# Altium project ADC_Comm.PrjPcb
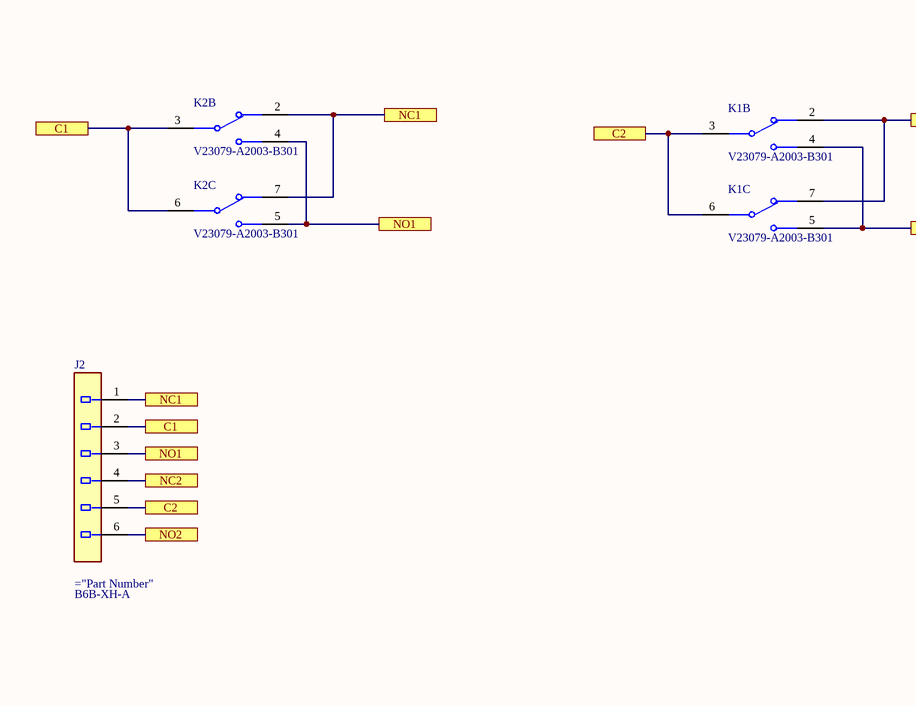
[diagram p0: ADC_Comm.SchDoc, top left]
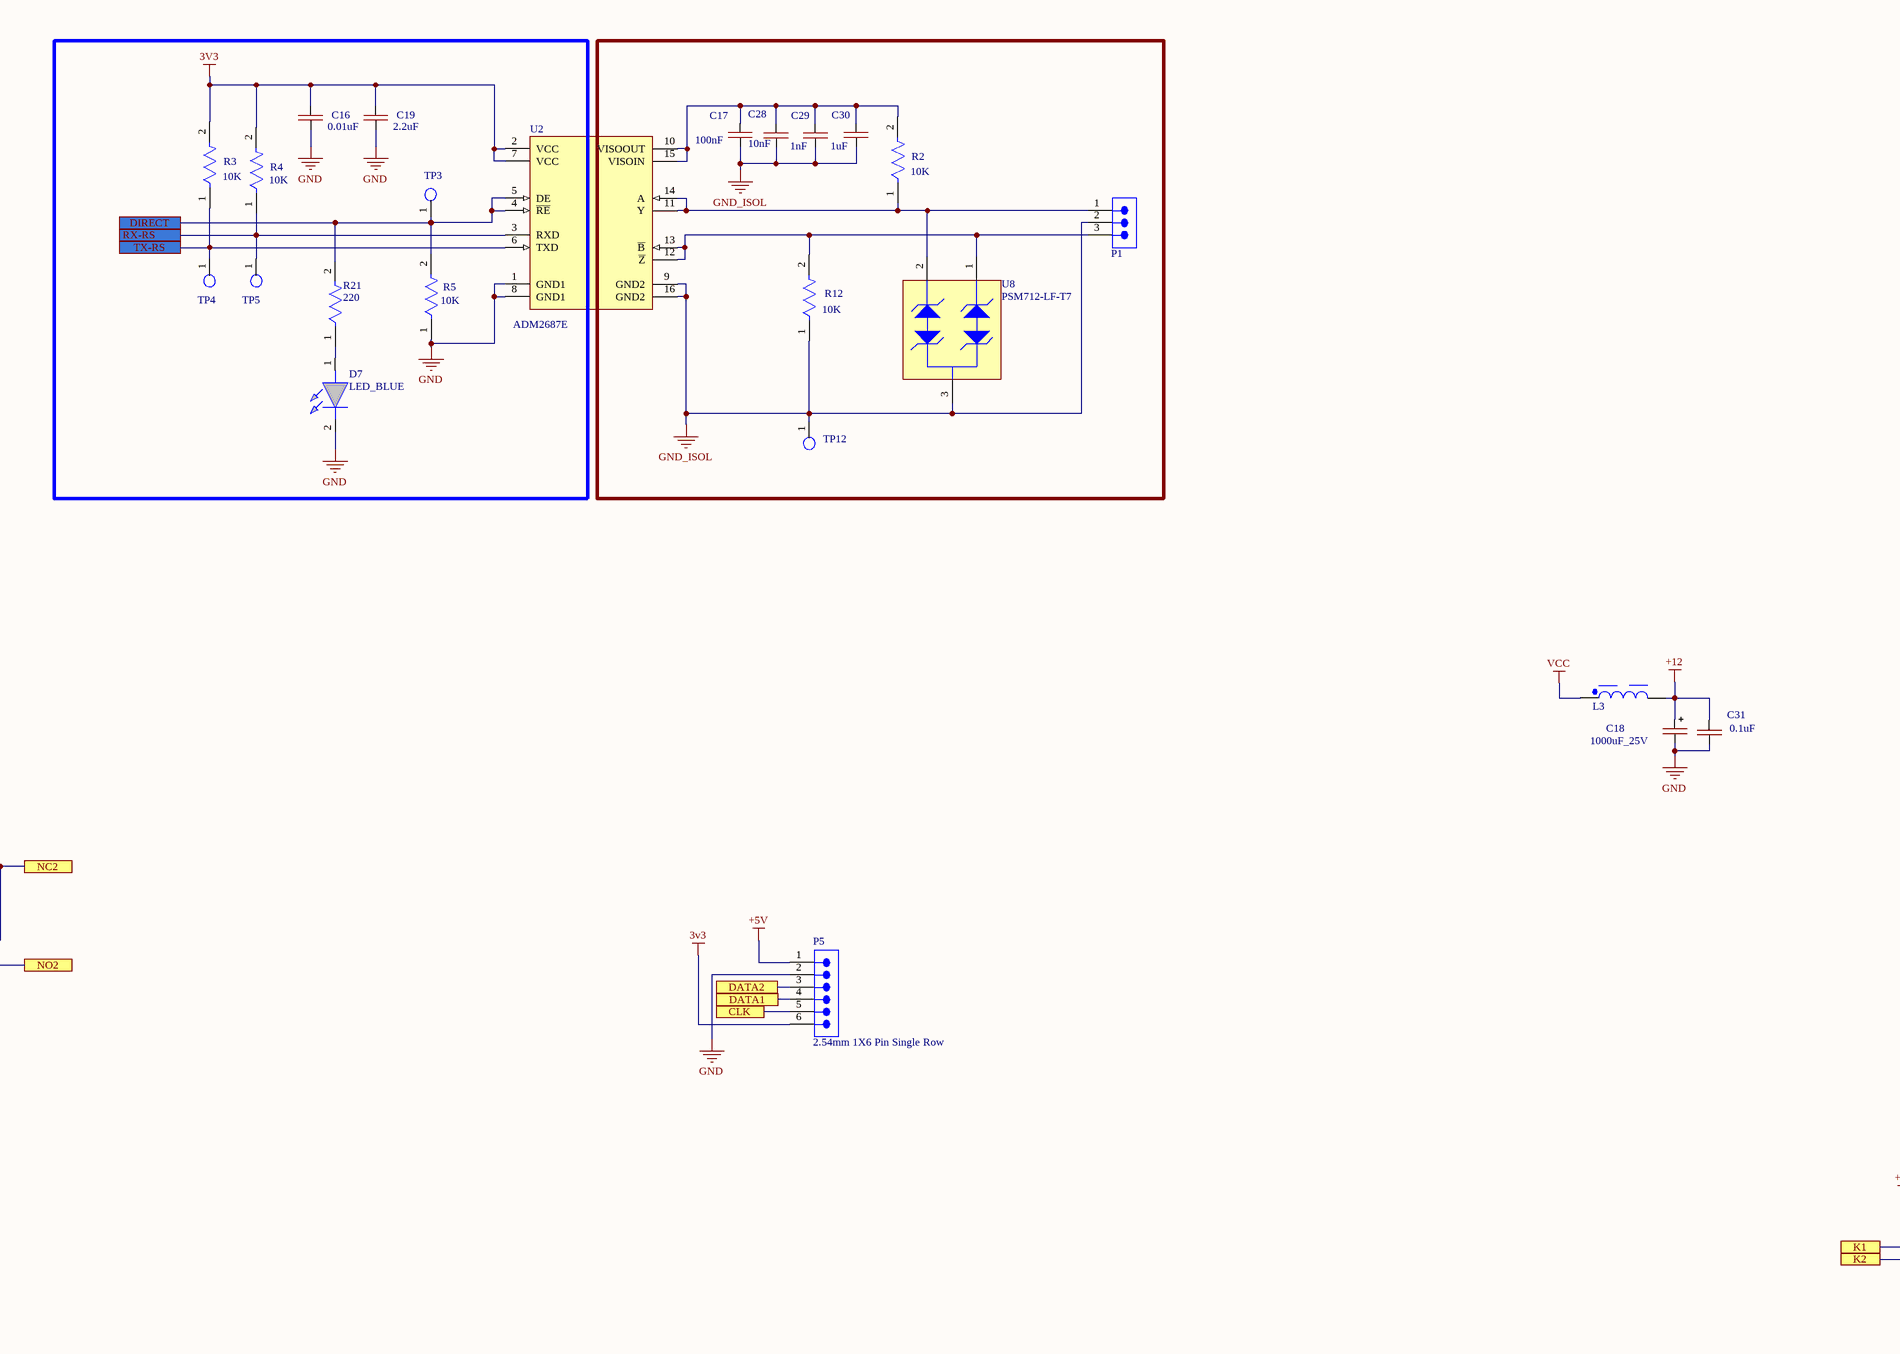
[diagram p1: ADC_Comm.SchDoc, top middle]
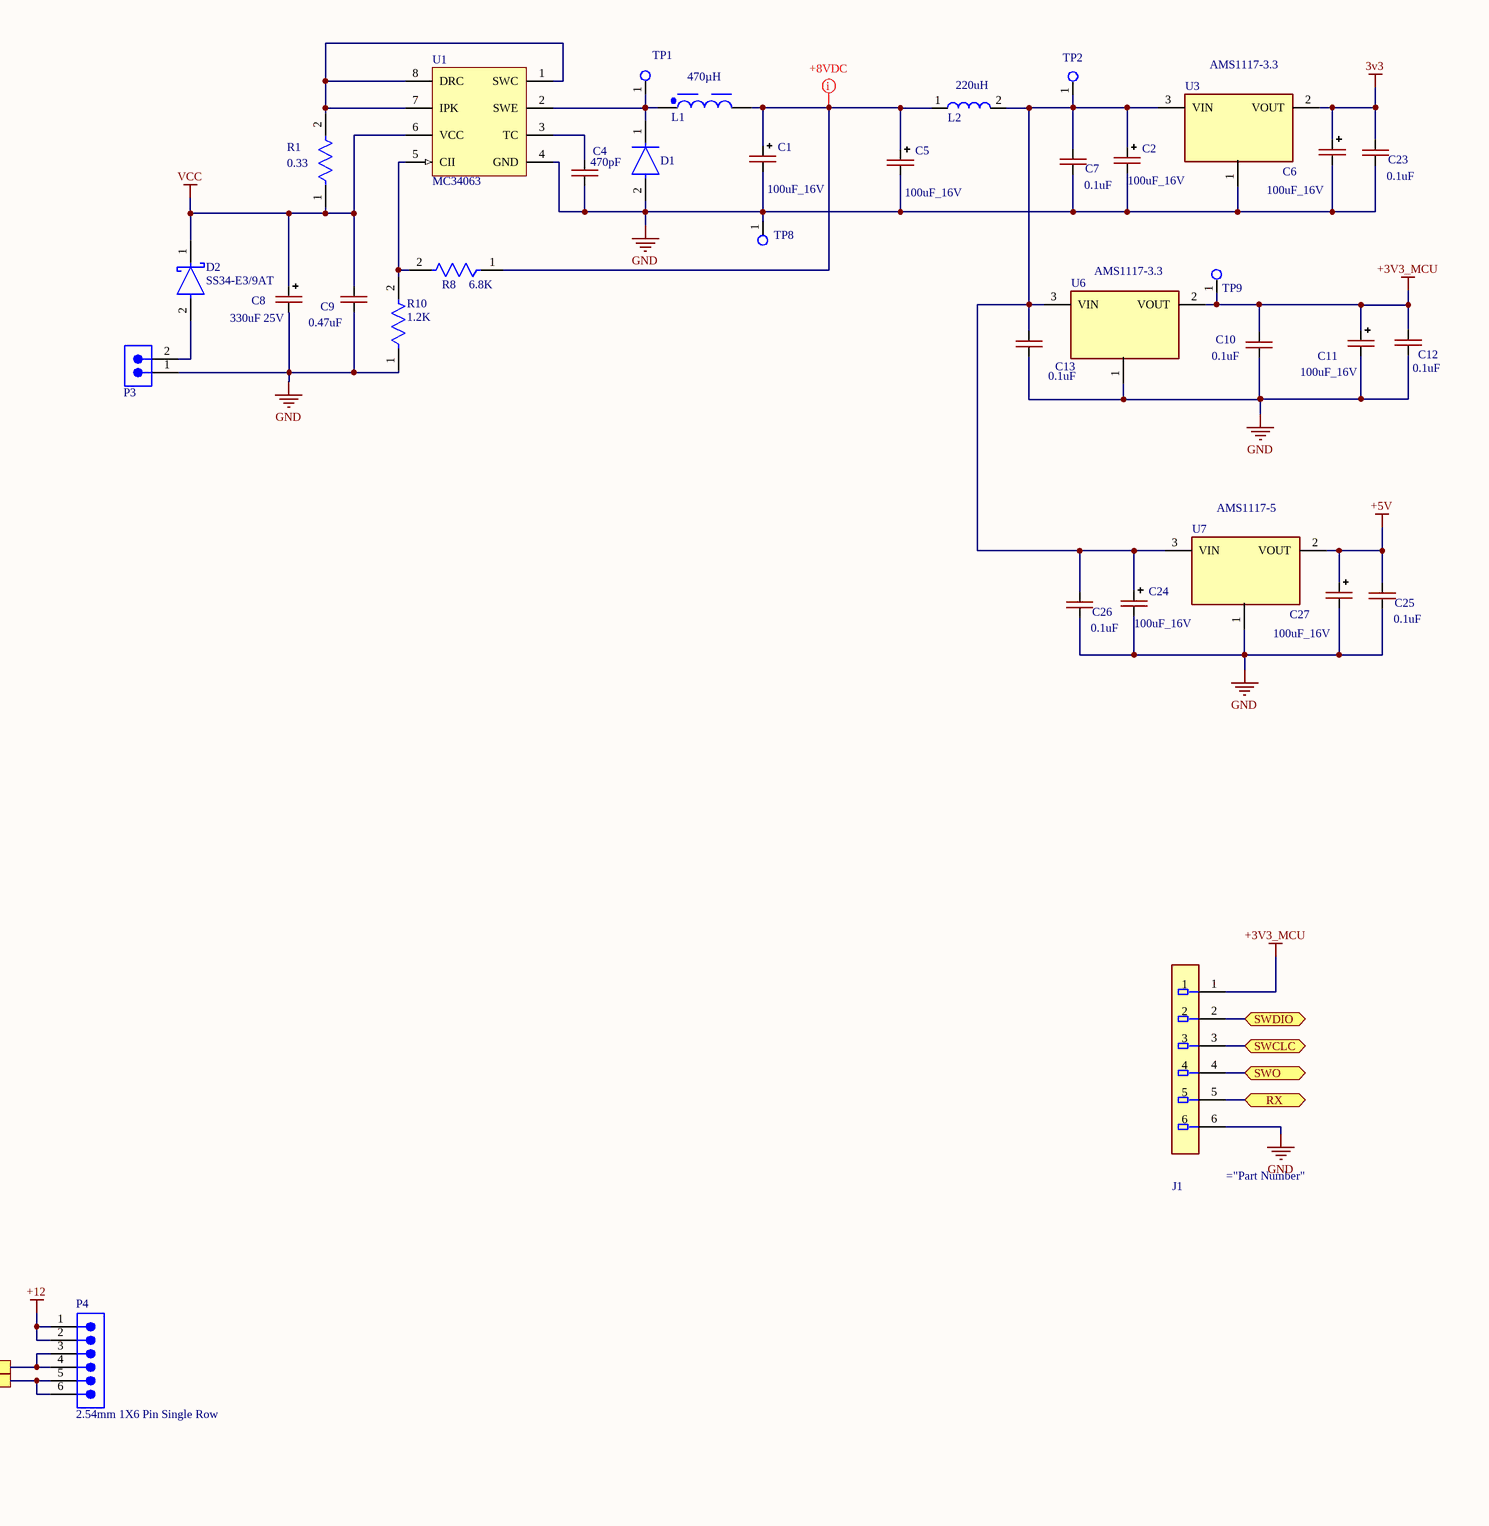
[diagram p2: ADC_Comm.SchDoc, top right]
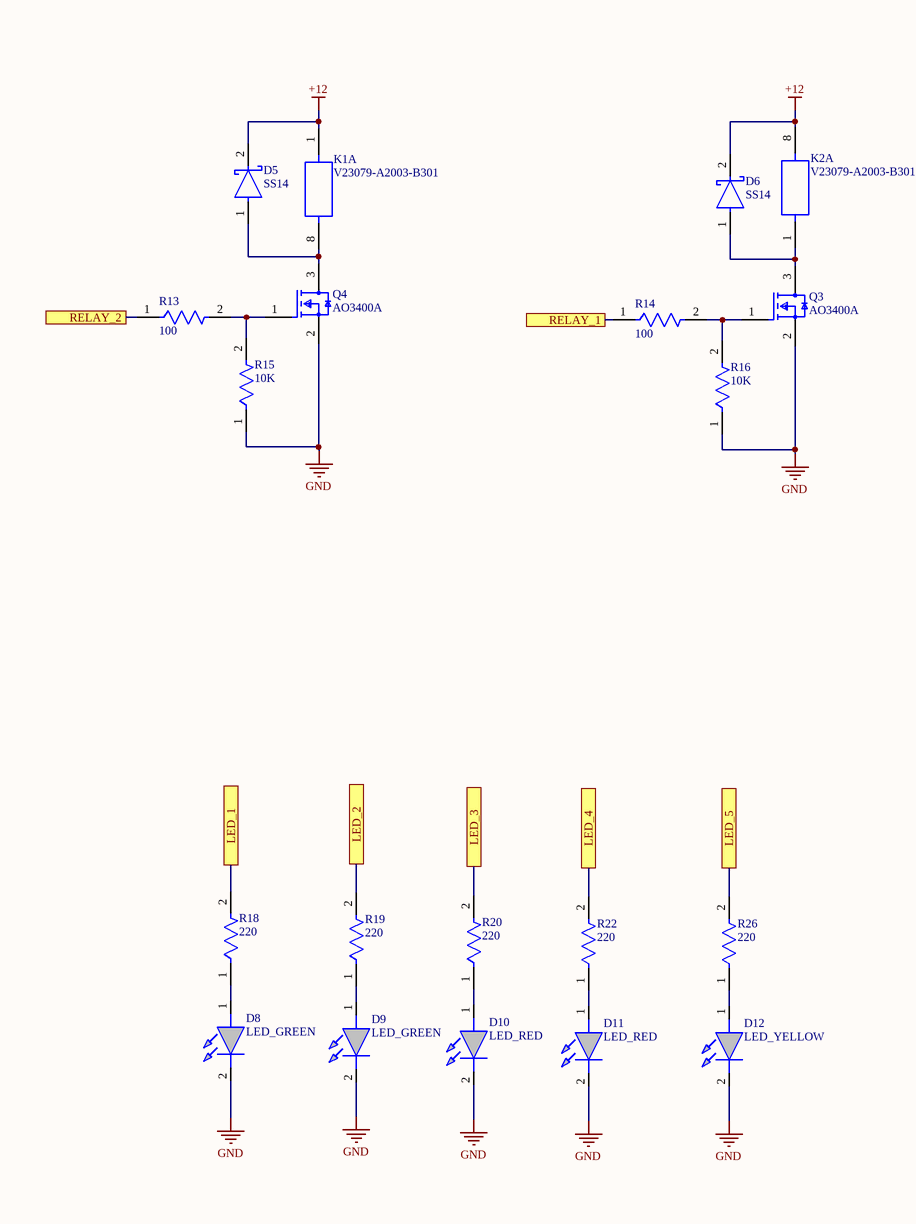
[diagram p3: ADC_Comm.SchDoc, bottom left]
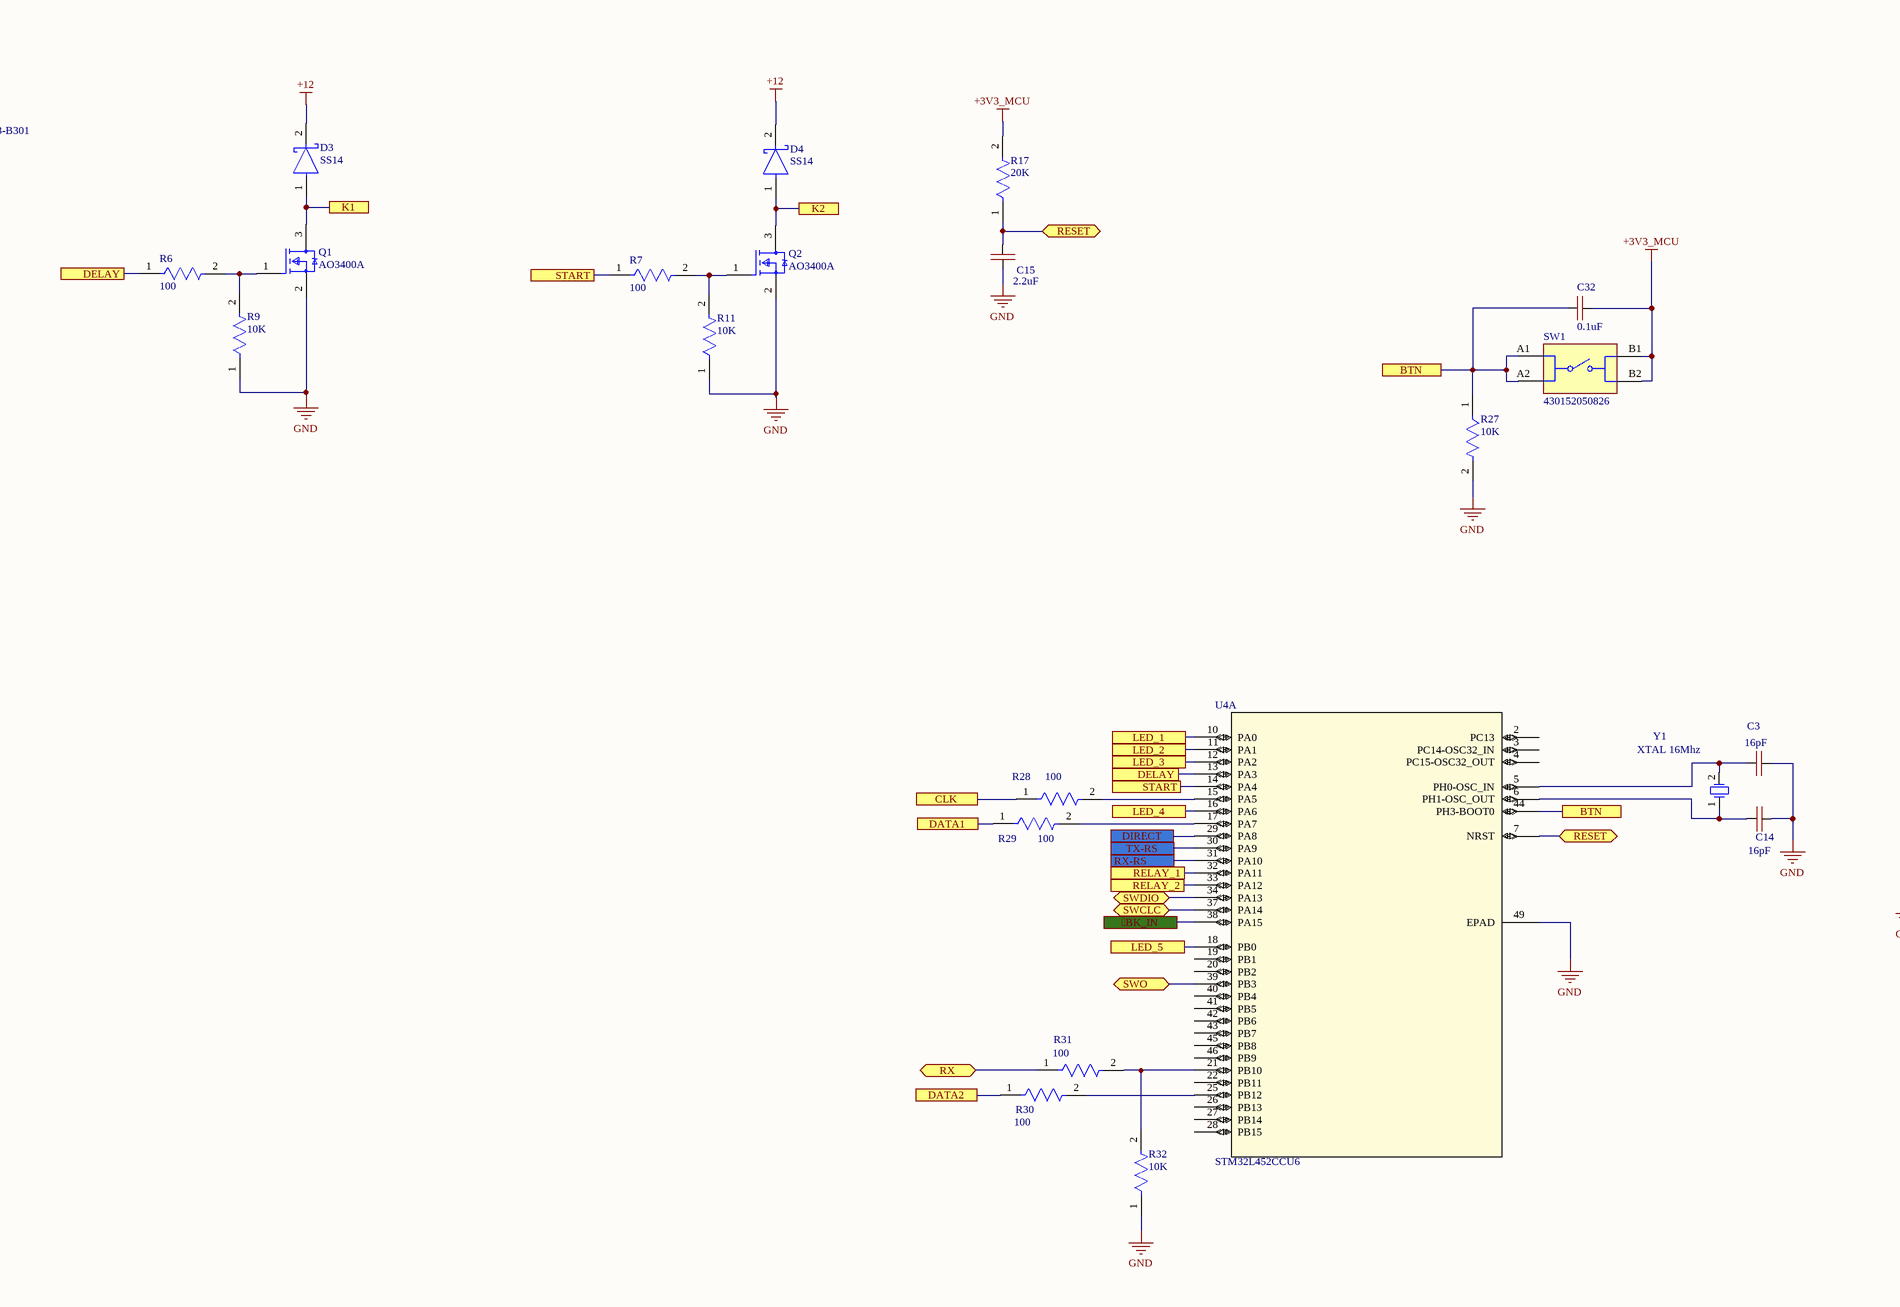
[diagram p4: ADC_Comm.SchDoc, bottom middle]
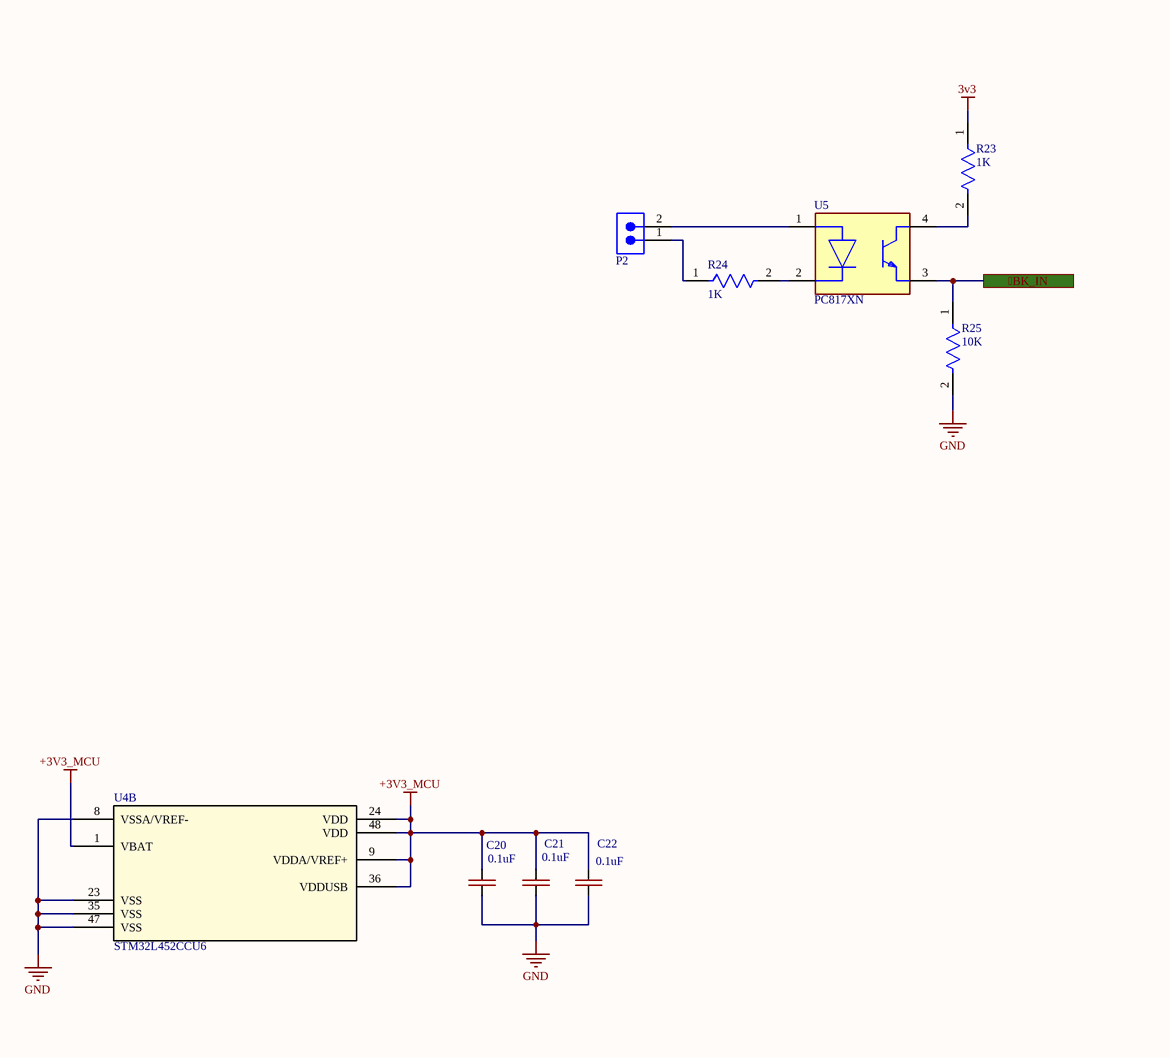
[diagram p5: ADC_Comm.SchDoc, bottom right]
1 sheet, 110 parts. Net scope: flat (ports and power ports of the same name join across sheets).
Board file: ADC_Comm.PcbDoc

## Sheet ADC_Comm.SchDoc
size A0; SheetNumber: 1; SheetTotal: 1; SPICEModelCacheIBWEWSKS: <root> / <DocumentId>IBWEWSKS</DocumentId> / <CacheFrame Number="0"> / <Model Name="5848_744774033_3.3u" Kind="CKT"> / <Text>******* / .subckt 5848_744774033_3.3u 1 2 / Rp 1 2 12000 / Cp 1 2 3.4p / Rs 1 N3 0.042 / L1 N3 2 3.3u / .ends 5848_744774033_3.3u</Text> / </Model> / <Model Name="1054_744776127_27u" Kind="CKT"> / <Text>******* / .subckt 1054_744776127_27u 1 2 / Rp 1 2 22000 / Cp 1 2 4.7p / Rs 1 N3 0.0627 / L1 N3 2 27u / .ends 1054_744776127_27u</Text> / </Model> / </CacheFrame> / </root>

### Parts
C1  100uF_16V  [CAP-TAN-D]
C2  100uF_16V  [CAP-TAN-D]
C3  16pF  [CAP-0402]
C4  470pF  [CAP-0603]
C5  100uF_16V  [CAP-TAN-D]
C6  100uF_16V  [CAP-TAN-D]
C7  0.1uF  [CAP-0603]
C8  330uF 25V  [CAP_SMD_Size_E]
C9  0.47uF  [CAP-0805]
C10  0.1uF  [CAP-0603]
C11  100uF_16V  [CAP-TAN-D]
C12  0.1uF  [CAP-0603]
C13  0.1uF  [CAP-0603]
C14  16pF  [CAP-0402]
C15  2.2uF  [CAP-0805]
C16  0.01uF  [CAP-0805]
C17  100nF  [CAP-0603]
C18  1000uF_25V  [CAP_SMD_SIZE_H]
C19  2.2uF  [CAP-0805]
C20  0.1uF  [CAP-0603]
C21  0.1uF  [CAP-0603]
C22  0.1uF  [CAP-0603]
C23  0.1uF  [CAP-0603]
C24  100uF_16V  [CAP-TAN-D]
C25  0.1uF  [CAP-0603]
C26  0.1uF  [CAP-0603]
C27  100uF_16V  [CAP-TAN-D]
C28  10nF  [CAP-0603]
C29  1nF  [CAP-0603]
C30  1uF  [CAP-0603]
C31  0.1uF  [CAP-0805]
C32  0.1uF  [CAP-0603]
D1  ES1G  [FP-403AE-MFG]  (value not drawn)
D2  SS34-E3/9AT  [FP-SMC-MFG]
D3  SS14  [DO-214-AC]
D4  SS14  [DO-214-AC]
D5  SS14  [DO-214-AC]
D6  SS14  [DO-214-AC]
D7  LED_BLUE  [LED_BLUE]
D8  LED_GREEN  [LED_GREEN]
D9  LED_GREEN  [LED_GREEN]
D10  LED_RED  [LED_RED]
D11  LED_RED  [LED_RED]
D12  LED_YELLOW  [LED_YELLOW]
J1  KF2510 Connector 2.54mm  [Sullins_SWR25X-NRTC-S06-ST-BA_MFG]  (value not drawn)
J2  B6B-XH-A  [B6B-XH-TW]
K1  V23079-A2003-B301  [V23079-A1001-B301]  (parts A,B,C of 3)
K2  V23079-A2003-B301  [V23079-A1001-B301]  (parts A,B,C of 3)
L1  470µH  [WE-PD2_5848]
L2  220uH  [Coil_4.5x4.5_mm]
L3  27µH, 1.95A  [WE-PD2_1054]  (value not drawn)
P1  691305340003  [691305340003]  (value not drawn)
P2  691322310002  [691322310002]  (value not drawn)
P3  691322310002  [691322310002]  (value not drawn)
P4  2.54mm 1X6 Pin Single Row  [PLS2.54 1x6 25mm]
P5  2.54mm 1X6 Pin Single Row  [PLS2.54 1x6 25mm]
Q1  AO3400A  [FP-SOT23-MFG]
Q2  AO3400A  [FP-SOT23-MFG]
Q3  AO3400A  [FP-SOT23-MFG]
Q4  AO3400A  [FP-SOT23-MFG]
R1  0.33  [RES-1206]
R2  10K  [RES-0603]
R3  10K  [RES-0603]
R4  10K  [RES-0603]
R5  10K  [RES-0603]
R6  100  [RES-0603]
R7  100  [RES-0603]
R8  6.8K  [RES-0805]
R9  10K  [RES-0603]
R10  1.2K  [RES-0805]
R11  10K  [RES-0603]
R12  10K  [RES-0603]
R13  100  [RES-0603]
R14  100  [RES-0603]
R15  10K  [RES-0603]
R16  10K  [RES-0603]
R17  20K  [RES-0603]
R18  220  [RES-0603]
R19  220  [RES-0603]
R20  220  [RES-0603]
R21  220  [RES-0603]
R22  220  [RES-0603]
R23  1K  [RES-0603]
R24  1K  [RES-0603]
R25  10K  [RES-0603]
R26  220  [RES-0603]
R27  10K  [RES-0603]
R28  100  [RES-0603]
R29  100  [RES-0603]
R30  100  [RES-0603]
R31  100  [RES-0603]
R32  10K  [RES-0603]
SW1  430152050826  [430152050826]
TP1  Test_Point_PCB  [Test_Point]  (value not drawn)
TP2  Test_Point_PCB  [Test_Point]  (value not drawn)
TP3  Test_Point_PCB  [Test_Point]  (value not drawn)
TP4  Test_Point_PCB  [Test_Point]  (value not drawn)
TP5  Test_Point_PCB  [Test_Point]  (value not drawn)
TP8  Test_Point_PCB  [Pin_Test_Point(Orange)]  (value not drawn)
TP9  Test_Point_PCB  [Test_Point]  (value not drawn)
TP12  Test_Point_PCB  [Test_Point]  (value not drawn)
U1  MC34063  [SOIC-8_M]
U2  ADM2687E  [ADI-RI-16-2_M]
U3  AMS1117-3.3  [SOT-89]
U4  STM32L452CCU6  [UFQFPN48-7x7mm_STM]  (parts A,B of 2)
U5  PC817XN  [FP-PC817XNNIP0F-MFG]
U6  AMS1117-3.3  [SOT-89]
U7  AMS1117-5  [SOT-89]
U8  PSM712-LF-T7  [PRKT-SOT23-3_V]
Y1  XTAL 16Mhz  [HC-49_SMD]

### Ports
BK_IN (see ADC_Comm[6C]), BK_IN (see ADC_Comm[11C]), BTN (see ADC_Comm[7C]), BTN (see ADC_Comm[8C]), C2 (see ADC_Comm[1B]), C2 (see ADC_Comm[2B]), CLK (see ADC_Comm[5B]), CLK (see ADC_Comm[6C]), DATA1 (see ADC_Comm[5B]), DATA1 (see ADC_Comm[6C]), DATA2 (see ADC_Comm[5B]), DATA2 (see ADC_Comm[6C]), DELAY (see ADC_Comm[3C]), DELAY (see ADC_Comm[6C]), DIRECT (see ADC_Comm[3A]), DIRECT (see ADC_Comm[6C]), K1 (see ADC_Comm[4B]), K1 (see ADC_Comm[9B]), K2 (see ADC_Comm[5B]), K2 (see ADC_Comm[9B]), LED_1 (see ADC_Comm[1C]), LED_1 (see ADC_Comm[6C]), LED_2 (see ADC_Comm[2C]), LED_2 (see ADC_Comm[6C]), LED_3 (see ADC_Comm[2C]), LED_3 (see ADC_Comm[6C]), LED_4 (see ADC_Comm[2C]), LED_4 (see ADC_Comm[6C]), LED_5 (see ADC_Comm[3C]), LED_5 (see ADC_Comm[6C]), NC1 (see ADC_Comm[1B]), NC1 (see ADC_Comm[2B]), NC2 (see ADC_Comm[1B]), NC2 (see ADC_Comm[3B]), NO1 (see ADC_Comm[1B]), NO1 (see ADC_Comm[2B]), NO2 (see ADC_Comm[1B]), NO2 (see ADC_Comm[3B]), RELAY_1 (see ADC_Comm[2C]), RELAY_1 (see ADC_Comm[6C]), RELAY_2 (see ADC_Comm[1C]), RELAY_2 (see ADC_Comm[6C]), RESET (bidir, see ADC_Comm[6B]), RESET (bidir, see ADC_Comm[8C]), RX (bidir, see ADC_Comm[6C]), RX (bidir, see ADC_Comm[12B]), RX-RS (see ADC_Comm[3A]), RX-RS (see ADC_Comm[6C]), START (see ADC_Comm[5C]), START (see ADC_Comm[6C]), SWCLC (bidir, see ADC_Comm[6C]), SWCLC (bidir, see ADC_Comm[12B]), SWDIO (bidir, see ADC_Comm[6C]), SWDIO (bidir, see ADC_Comm[12B]), SWO (bidir, see ADC_Comm[6C]), SWO (bidir, see ADC_Comm[12B]), TX-RS (see ADC_Comm[3A]), TX-RS (see ADC_Comm[6C]), С1 (see ADC_Comm[1B])

### Nets
3v3: C6.1(+) C16.1 C19.1 C23.2 P5.6 R3.2 R4.2 R23.1 U2.2(VCC) U2.7(VCC) U3.2(VOUT)
+3V3_MCU: C10.2 C11.1(+) C12.2 C20.2 C21.2 C22.2 C32.1 J1.1 R17.2 SW1.B1 SW1.B2 TP9.1(G9) U4.1(VBAT) U4.9(VDDA/VREF+) U4.24(VDD) U4.36(VDDUSB) U4.48(VDD) U6.2(VOUT)
+5V: C25.2 C27.1(+) P5.1 U7.2(VOUT)
+12: C18.1(+) C31.2 D3.2(C) D4.2(C) D5.2(C) D6.2(C) K1.1 K2.8 L3.2 P4.1 P4.2
GND: C1.2(-) C2.2(-) C3.1 C4.2 C5.2(-) C6.2(-) C7.1 C8.2(-) C9.2 C10.1 C11.2(-) C12.1 C13.1 C14.2 C15.1 C16.2 C18.2(-) C19.2 C20.1 C21.1 C22.1 C23.1 C24.2(-) C25.1 C26.1 C27.2(-) C31.1 D1.2(A) D7.2(K) D8.2(K) D9.2(K) D10.2(K) D11.2(K) D12.2(K) J1.6 P3.1 P5.2 Q1.2(S) Q2.2(S) Q3.2(S) Q4.2(S) R5.1 R9.1 R10.1 R11.1 R15.1 R16.1 R25.2 R27.2 R32.1 TP8.1(G9) U1.4(GND) U2.1(GND1) U2.8(GND1) U3.1(Ground) U4.8(VSSA/VREF-) U4.23(VSS) U4.35(VSS) U4.47(VSS) U4.49(EPAD) U6.1(Ground) U7.1(Ground)
GND_ISOL: C17.2 C28.2 C29.2 C30.2 P1.2 R12.1 TP12.1(G9) U2.9(GND2) U2.16(GND2) U8.3
VCC: C8.1(+) C9.1 D2.1(C) L3.1 R1.1 U1.6(VCC)
NetC1_1: C1.1(+) C5.1(+) L1.2 L2.1 R8.1
NetC2_1: C2.1(+) C7.2 C13.2 C24.1(+) C26.2 L2.2 TP2.1(G9) U3.3(VIN) U6.3(VIN) U7.3(VIN)
NetC3_2: C3.2 U4.5(PH0-OSC_IN) Y1.2
NetC4_1: C4.1 U1.3(TC)
NetC14_1: C14.1 U4.6(PH1-OSC_OUT) Y1.1
NetC15_2: C15.2 R17.1 U4.7(NRST) ; port RESET
NetC17_1: C17.1 C28.1 C29.1 C30.1 R2.2 U2.10(VISOOUT) U2.15(VISOIN)
NetC32_2: C32.2 R27.1 SW1.A1 SW1.A2 U4.44(PH3-BOOT0) ; port BTN
NetD1_1: D1.1(C) L1.1 TP1.1(G9) U1.2(SWE)
NetD2_2: D2.2(A) P3.2
NetD3_1: D3.1(A) P4.3 P4.4 Q1.3(D) ; port K1
NetD4_1: D4.1(A) P4.5 P4.6 Q2.3(D) ; port K2
NetD5_1: D5.1(A) K1.8 Q4.3(D)
NetD6_1: D6.1(A) K2.1 Q3.3(D)
NetD7_1: D7.1(A) R21.1
NetD8_1: D8.1(A) R18.1
NetD9_1: D9.1(A) R19.1
NetD10_1: D10.1(A) R20.1
NetD11_1: D11.1(A) R22.1
NetD12_1: D12.1(A) R26.1
NetJ1_2: J1.2 U4.34(PA13) ; port SWDIO
NetJ1_3: J1.3 U4.37(PA14) ; port SWCLC
NetJ1_4: J1.4 U4.39(PB3) ; port SWO
NetJ1_5: J1.5 R31.1 ; port RX
NetJ2_1: J2.1 K2.2 K2.7 ; port NC1
NetJ2_2: J2.2 K2.3 K2.6 ; port С1
NetJ2_3: J2.3 K2.4 K2.5 ; port NO1
NetJ2_4: J2.4 K1.2 K1.7 ; port NC2
NetJ2_5: J2.5 K1.3 K1.6 ; port C2
NetJ2_6: J2.6 K1.4 K1.5 ; port NO2
NetP1_1: P1.1 R2.1 U2.11(Y) U2.14(A) U8.2
NetP1_3: P1.3 R12.2 U2.12(~{Z}) U2.13(~{B}) U8.1
NetP2_1: P2.1 R24.1
NetP2_2: P2.2 U5.1(A)
NetP5_3: P5.3 R30.1 ; port DATA2
NetP5_4: P5.4 R29.1 ; port DATA1
NetP5_5: P5.5 R28.1 ; port CLK
NetQ1_1: Q1.1(G) R6.2 R9.2
NetQ2_1: Q2.1(G) R7.2 R11.2
NetQ3_1: Q3.1(G) R14.2 R16.2
NetQ4_1: Q4.1(G) R13.2 R15.2
NetR1_2: R1.2 U1.1(SWC) U1.7(IPK) U1.8(DRC)
NetR3_1: R3.1 TP4.1(G9) U2.6(TXD) U4.30(PA9) ; port TX-RS
NetR4_1: R4.1 TP5.1(G9) U2.3(RXD) U4.31(PA10) ; port RX-RS
NetR5_2: R5.2 R21.2 TP3.1(G9) U2.4(~{RE}) U2.5(DE) U4.29(PA8) ; port DIRECT
NetR6_1: R6.1 U4.13(PA3) ; port DELAY
NetR7_1: R7.1 U4.14(PA4) ; port START
NetR8_2: R8.2 R10.2 U1.5(CII)
NetR13_1: R13.1 U4.33(PA12) ; port RELAY_2
NetR14_1: R14.1 U4.32(PA11) ; port RELAY_1
NetR18_2: R18.2 U4.10(PA0) ; port LED_1
NetR19_2: R19.2 U4.11(PA1) ; port LED_2
NetR20_2: R20.2 U4.12(PA2) ; port LED_3
NetR22_2: R22.2 U4.16(PA6) ; port LED_4
NetR23_2: R23.2 U5.4(C)
NetR24_2: R24.2 U5.2(C)
NetR25_1: R25.1 U4.38(PA15) U5.3(E) ; port BK_IN
NetR26_2: R26.2 U4.18(PB0) ; port LED_5
NetR28_2: R28.2 U4.15(PA5)
NetR29_2: R29.2 U4.17(PA7)
NetR30_2: R30.2 U4.25(PB12)
NetR31_2: R31.2 R32.2 U4.21(PB10)

Not connected (* = marked no-connect by the designer): U4 2(PC13) 3(PC14-OSC32_IN) 4(PC15-OSC32_OUT) 19(PB1) 20(PB2) 22(PB11) 26(PB13) 27(PB14) 28(PB15) 40(PB4) 41(PB5) 42(PB6) 43(PB7) 45(PB8) 46(PB9)

### Layout directives
mark named +8VDC: (no net found under the mark)

### Library data of the parts
C1 C2 C5 C6 C8 C24 C27 = CAP_POL_SMD
C3 C4 C7 C9 C10 C12-C17 C19-C23 C25 C26 C28-C32 = CAP-NON-POLAR
C11 = CAP-POLAR
C18 = CAP_POL_SMD: 1000uF_25V  12.5x13mm
D1 = ES1G: Ultrafast
D2 = CMP-02539-000066-1: DIODE SCHOTTKY 40V 3A DO214AB; Peak Non-Repetitive Surge Current: 100A; Forward Voltage: 500mV; Element Configuration: Single; Max Reverse Current: 500uA; Case/Package: SMC; Radiation Hardening: No; Series: -; Max Surge Current: 100A; RoHS Compliant: Yes; Min Operating Temperature: -55°C; Average Rectified Current: 3A; Max Reverse Leakage Current: 500uA; Package Quantity: 3500; Max Reverse Voltage (DC): 40V; Forward Current: 3A; Packaging: Tape and Reel; Max Operating Temperature: 125°C; Max Repetitive Reverse Voltage (Vrrm): 40V; Number of Pins: 2; Mount: Surface Mount
D7 = LED: 0805; Manufacturer_Name: Wurth Elektronik; Manufacturer_Part_Number: 151031YS06000; Geometry.Height: 5.5mm; Mouser Part Number: 710-151031YS06000; Mouser Price/Stock: https://www.mouser.co.uk/ProductDetail/Wurth-Elektronik/151031YS06000?qs=LlUlMxKIyB3xSYYW%252BcuBiQ%3D%3D; Arrow Part Number: *; Arrow Price/Stock: *; Mouser Testing Part Number: *; Mouser Testing Price/Stock: *; Datasheet Link: https://katalog.we-online.de/led/datasheet/151031YS06000.pdf
D8-D12 = LED: Manufacturer_Name: Wurth Elektronik; Manufacturer_Part_Number: 151031YS06000; Geometry.Height: 5.5mm; Mouser Part Number: 710-151031YS06000; Mouser Price/Stock: https://www.mouser.co.uk/ProductDetail/Wurth-Elektronik/151031YS06000?qs=LlUlMxKIyB3xSYYW%252BcuBiQ%3D%3D; Arrow Part Number: *; Arrow Price/Stock: *; Mouser Testing Part Number: *; Mouser Testing Price/Stock: *; Datasheet Link: https://katalog.we-online.de/led/datasheet/151031YS06000.pdf
J1 = SWR25X-NRTC-S06-ST-BA
J2 = B6B-XH-TW
K1 K2 = F1CA005V: V23079-A2003-B301 12VDC 1A Tyco axicom
L1 = 744774033: MSRH5D28-471MT; Manufacturer: Wurth Elektronik; Match Code: WE-PD2; Case/Size Code: 5848; DC Resistance: 0.042Ω; DC Resistance Max: 0.06Ω; Inductance: 3.3µH; Rated Current: 4A; Saturation Current: 7.5A; Self Resonant Frequency: 43MHz; Manufacturer Part Number: 744774033; Category: Unshielded Power Inductors; ComponentLink1Description: Website Link; ComponentLink1URL: https://www.we-online.com/redexpert/article/744774033?ad; ComponentLink2Description: Datasheet Link; ComponentLink2URL: https://www.we-online.com/redexpert/spec/744774033?ad; Mount: Surface Mount; Operating Temperature Max: 125°C; Operating Temperature Min: -40°C; Packaging: Tape and Reel; Length: 5.8mm; Width: 5.2mm; Height: 4.5mm
L2 = Coil
L3 = 744776127: WE-PD2 SMT Power Inductor, size 1054, 27µH, 1.95A, 0.11Ω; Manufacturer: Wurth Elektronik; Case/Size Code: 1054; DC Resistance: 0.063Ω; Saturation Current: 1.98A; Self Resonant Frequency: 15MHz; Manufacturer Part Number: 744776127; Category: Unshielded Power Inductors; Match Code: WE-PD2; ComponentLink1Description: Website Link; ComponentLink1URL: https://www.we-online.com/redexpert/article/744776127?ad; ComponentLink2Description: Datasheet Link; ComponentLink2URL: https://www.we-online.com/redexpert/spec/744776127?ad; Mount: Surface Mount; Operating Temperature Max: 125°C; Operating Temperature Min: -40°C; Packaging: Tape and Reel; Length: 10mm; Width: 9mm; Height: 5.4mm; DC Resistance Max: 0.11Ω; Inductance: 27µH; Rated Current: 1.95A
P1 = 691305340003: WR-TBL Series 3053 Horizontal PCB Header, THT, pitch 3.81mm, 3p; Manufacturer: Wurth Elektronik; Modularity: No; Rated Current: 12A; Working Voltage: 300V; ComponentLink1Description: Website Link; ComponentLink1URL: https://www.we-online.com/redexpert/article/691305340003?ad; ComponentLink2Description: Datasheet Link; ComponentLink2URL: https://www.we-online.com/redexpert/spec/691305340003?ad; Manufacturer Part Number: 691305340003; Category: Terminal Blocks; Match Code: WR-TBL; Mount: Through Hole; Operating Temperature Max: 105°C; Operating Temperature Min: -40°C; Packaging: Box; Application: Pluggable; Number of Pins: 3; Number of Rows: 1; Orientation: Horizontal; Pitch: 3.81mm
P2 P3 = 691322310002: WR-TBL Series 322 Horizontal PCB Header, THT, pitch 3.81mm, 2p; Manufacturer: Wurth Elektronik; Modularity: No; Rated Current: 10A; Working Voltage: 300V; ComponentLink1Description: Website Link; ComponentLink1URL: https://www.we-online.com/redexpert/article/691322310002?ad; ComponentLink2Description: Datasheet Link; ComponentLink2URL: https://www.we-online.com/redexpert/spec/691322310002?ad; Manufacturer Part Number: 691322310002; Category: Terminal Blocks; Match Code: WR-TBL; Mount: Through Hole; Operating Temperature Max: 105°C; Operating Temperature Min: -40°C; Packaging: Box; Application: Pluggable; Number of Pins: 2; Number of Rows: 1; Orientation: Horizontal; Pitch: 3.81mm
P4 P5 = 2.54mm 1X6 Pin Single Row Male  25mm: 2.54mm 1X6 Pin Single Row Male Connector PCB  25mm 1X6P Strip Pinheader
Q1-Q4 = CMP-83955-000006-1: MOSFET N-CH 30V 5.7A SOT23; Input Capacitance: 630pF; Number of Elements: 1; Rds On Max: 26.5mR; Max Power Dissipation: 1.4W; Gate to Source Voltage (Vgs): 12V; Min Operating Temperature: -55°C; Lead Free: Lead Free; Number of Pins: 3; Drain to Source Voltage (Vdss): 30V; Case/Package: SOT-23; Mount: Surface Mount; Continuous Drain Current (ID): 5.7A; Radiation Hardening: No; Packaging: Tape and Reel; Max Operating Temperature: 150°C; Power Dissipation: 1.4W
R1-R32 = RES-CONST
SW1 = 430152050826: WS-TASV SMT Tact Switch, 6mm x 6mm, 260gf, SPST-NO, 12V, 50mA; Manufacturer: Wurth Elektronik; Washable: No; Manufacturer Part Number: 430152050826; Category: Tact Switch; Match Code: WS-TASV; ComponentLink1Description: Website Link; ComponentLink1URL: https://www.we-online.com/redexpert/article/430152050826?ad; ComponentLink2Description: Datasheet Link; ComponentLink2URL: https://www.we-online.com/redexpert/spec/430152050826?ad; Mount: Surface Mount; Min Operating Temperature: -40°C; Max Operating Temperature: 85°C; Packaging: Tape and Reel; Length: 6mm; Width: 6mm; Height: 5mm; Circuit: SPST-NO; Contact Material: Stainless Steel; Contact Plating: Silver; Operation Force: 260gf; Rated Current: 50mA; Rated Voltage (DC): 12V; Terminal Material: Copper Alloy; Terminal Plating: Silver
TP1-TP5 TP8 TP9 TP12 = TP_PCB?: Test_Point
U3 U6 U7 = AMS1117
U8 = CMP-2000-07553-1: TVS Array - Asymmetrical Data Line Protector, 600 W, 7.5 V, -55 to 150 degC, 3-Pin SOT23, RoHS, Tape and Reel; Manufacturer: Protek Devices; Min Breakdown Voltage: 7.5V; Direction: Bidirectional; Capacitance: 75pF; Current: 20uA; Power Dissipation: 600W; Working Voltage: 7V; Voltage: 12V; Case\/Package: SOT-23; Clamping Voltage: 17V; Element Configuration: Dual; Mounting Technology: SurfaceMount; RoHSCompliant: True; Radiation Hardening: No; Depth: 1.4mm; Lead Free: LeadFree; Package Description: 3-Pin Small Outline Transistor, Body 2.92 x 1.3 mm, Pitch 0.94 mm; Max Operating Temperature: 150degC; Length: 3.04mm; Manufacturer URL: http://www.protekdevices.com/; Min Operating Temperature: -55degC; Leakage Current: 20uA; Datasheet URL: www.protekdevices.com/xyz/documents/datasheets/psm712.pdf; Packaging: TapeandReel; Datasheet Version: 10/2013; Package Reference: SOT23-3; Number of Pins: 3